# Altium schematic sheet Connectors&PIN_Header.SchDoc
size A4; CompanyName: Technische Hochschule Nürnberg Georg Simon Ohm; Organization: UltraZohm; Address1: Kesslerplatz 12; Address2: 90489 Nürnberg; Address3: GERMANY; SheetNumber: 2; SheetTotal: 5; Website: www.ultrazohm.com
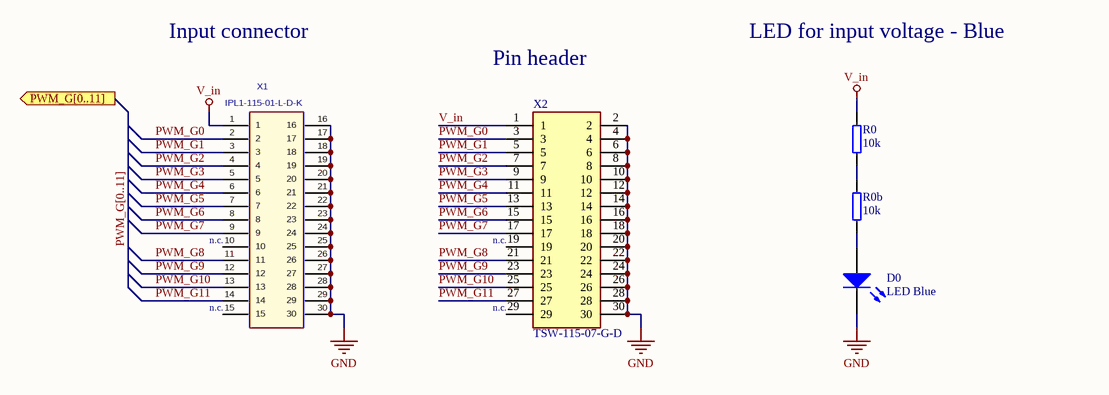
[diagram p0: Connectors&PIN_Header.SchDoc]

## Parts
D0  LED Blue  [WL-SMCW_0603]
R0  10k  [RES 0603_1608]
R0b  10k  [RES 0603_1608]
X1  IPL1-115-01-L-D-K  [IPL1-115-01-YYY-D-K]
X2  TSW-115-07-G-D  [TSW-115-XX-YY-D]

## Ports
PWM_G[0..11] (out)

## Nets
GND: D0.1(K) X1.16 X1.17 X1.18 X1.19 X1.20 X1.21 X1.22 X1.23 X1.24 X1.25 X1.26 X1.27 X1.28 X1.29 X1.30 X2.2 X2.4 X2.6 X2.8 X2.10 X2.12 X2.14 X2.16 X2.18 X2.20 X2.22 X2.24 X2.26 X2.28 X2.30
V_in: R0.2 X1.1 X2.1
PWM_G0: X1.2 X2.3
PWM_G1: X1.3 X2.5
PWM_G2: X1.4 X2.7
PWM_G3: X1.5 X2.9
PWM_G4: X1.6 X2.11
PWM_G5: X1.7 X2.13
PWM_G6: X1.8 X2.15
PWM_G7: X1.9 X2.17
PWM_G8: X1.11 X2.21
PWM_G9: X1.12 X2.23
PWM_G10: X1.13 X2.25
PWM_G11: X1.14 X2.27
NetD0_2: D0.2(A) R0b.1
NetR0_1: R0.1 R0b.2

Not connected (* = marked no-connect by the designer): X1 10 15; X2 19 29

## Buses and harness runs
bus PWM_G[0..11] = port PWM_G[0..11]

## Notes on the sheet
- Input connector
- LED for input voltage - Blue
- Pin header
- (near X1) n.c.
- (near X2) n.c.
- Title
- Revision:
- Design Engineer:
- Date:
- Project:
- Sheet
- of

## Library data of the parts
D0 = UZgen_LED_0603_Blue: Standard LEDs - SMD 0603 blue; Manufacturer: UZgen; Created from: UZgenTool; Manufacturer Part Number: UZgen_LED_0603_Blue; PartID: 20; Created On: 09.09.2024 10:45:01; ComponentLink1Description: N/A; ComponentLink1URL: N/A; Component Type: LED Diode; Device Package: 0603; Last Updated: 09.09.2024 10:45:01; Mounting Type: SMD; Supplier 1: LCSC; Supplier Part Number 1: C5197644; Type: Standard; Value: LED Blue; Live Cycle Status: 1; Stock number: not stored; Color: blue; LCSC Part Number: C5197644
R0 R0b = RQ73C1J10KBTD: SMD resistor 0.1%, 10ppm; Manufacturer: TE Connectivity; Created from: DHufnagel; Manufacturer Part Number: RQ73C1J10KBTD; PartID: 231; Created On: 14.12.2020 16:17:14; ComponentLink1Description: Datasheet; ComponentLink1URL: https://www.mouser.de/datasheet/2/418/5/ENG_DS_1773270_2_B-1533717.pdf; Component Type: SMD resistor; Device Package: 0603; Last Updated: 21.02.2024 15:51:17; Mounting Type: SMD; Supplier 1: Mouser; Supplier Part Number 1: 279-RQ73C1J10KBTD; Supplier 2: LCSC; Supplier Part Number 2: C25804; Type: Resistor; Tolerance: 0.1%; Value: 10k; Live Cycle Status: 1; Stock number: not stored; LCSC Part Number: C25804
X1 = IPL1-115-01-L-D-K: 2.54 mm Double Row Terminal Assembly; Manufacturer: SAMTEC; Created from: MGremer; Number of positions: 30; Manufacturer Part Number: IPL1-115-01-L-D-K; PartID: 28; Created On: 01.12.2020 18:14:32; ComponentLink1Description: Homepage; ComponentLink1URL: https://www.samtec.com/de/products/ipl1; Component Type: Samtec Connector; Device Package: Connector; Last Updated: 15.02.2021 10:08:03; Mounting Type: THT; Supplier 1: SAMTEC; Supplier Part Number 1: IPL1-115-01-L-D-K; Type: Connector; Live Cycle Status: 1; Number of rows: 2; Stock number: not stored; LCSC Part Number: C17431809
X2 = TSW-115-07-G-D: 2x15 Pins; Manufacturer_Name: SAMTEC; Created from: JHahn; Mouser Part Number: 200-TSW11507GD; Mouser Price/Stock: https://www.mouser.co.uk/ProductDetail/Samtec/TSW-115-07-G-D?qs=rU5fayqh%252BE0Fz7QdY5Xmuw%3D%3D; Manufacturer_Part_Number: TSW-115-07-G-D; Datasheet Link: http://suddendocs.samtec.com/prints/tsw-xxx-xx-xxx-x-xx-xxx-mkt.pdf; Manufacturer Part Number: TSW-115-07-G-D; PartID: 18; Created On: 07.04.2026 13:32:57; ComponentLink1Description: Datasheet; ComponentLink1URL: http://suddendocs.samtec.com/prints/tsw-xxx-xx-xxx-x-xx-xxx-mkt.pdf; Component Type: Pin Header; Device Package: THT; Last Updated: 07.04.2026 14:32:10; Manufacturer: SAMTEC; Mounting Type: THT; Operating Temperature: -55 +125 °C; Series: TSW; Supplier 1: Mouser; Supplier Part Number 1: 200-TSW11507GD; Type: Pin Header; Live Cycle Status: 1; LCSC Part Number: C5994596; Stock number: 15